# Altium project PrintingProjectAllDocs.PrjPCB (part 3 of 3)

## Sheet TemperatureSensorBlock.SchDoc: Temperature Sensor Controller
size B; Author: Levi Balling; CompanyName: Smart Home; DrawnBy: Levi Balling; Engineer: Levi Balling; Organization: U of U Computer Engineering; Address1: 50 S. Central Campus Dr.; Address2: Rm. 3280 MEB; Address3: Salt Lake City, UT; Address4: Australia 2086; DocumentNumber: 1; Revision: 2; SheetNumber: 10; SheetTotal: 13; Website: www.eng.utah.edu/~lballing/SmartHome; Project: Smart Home; Description: This board will Take temperature samples from 32 locations; ProjectName: Smart Home
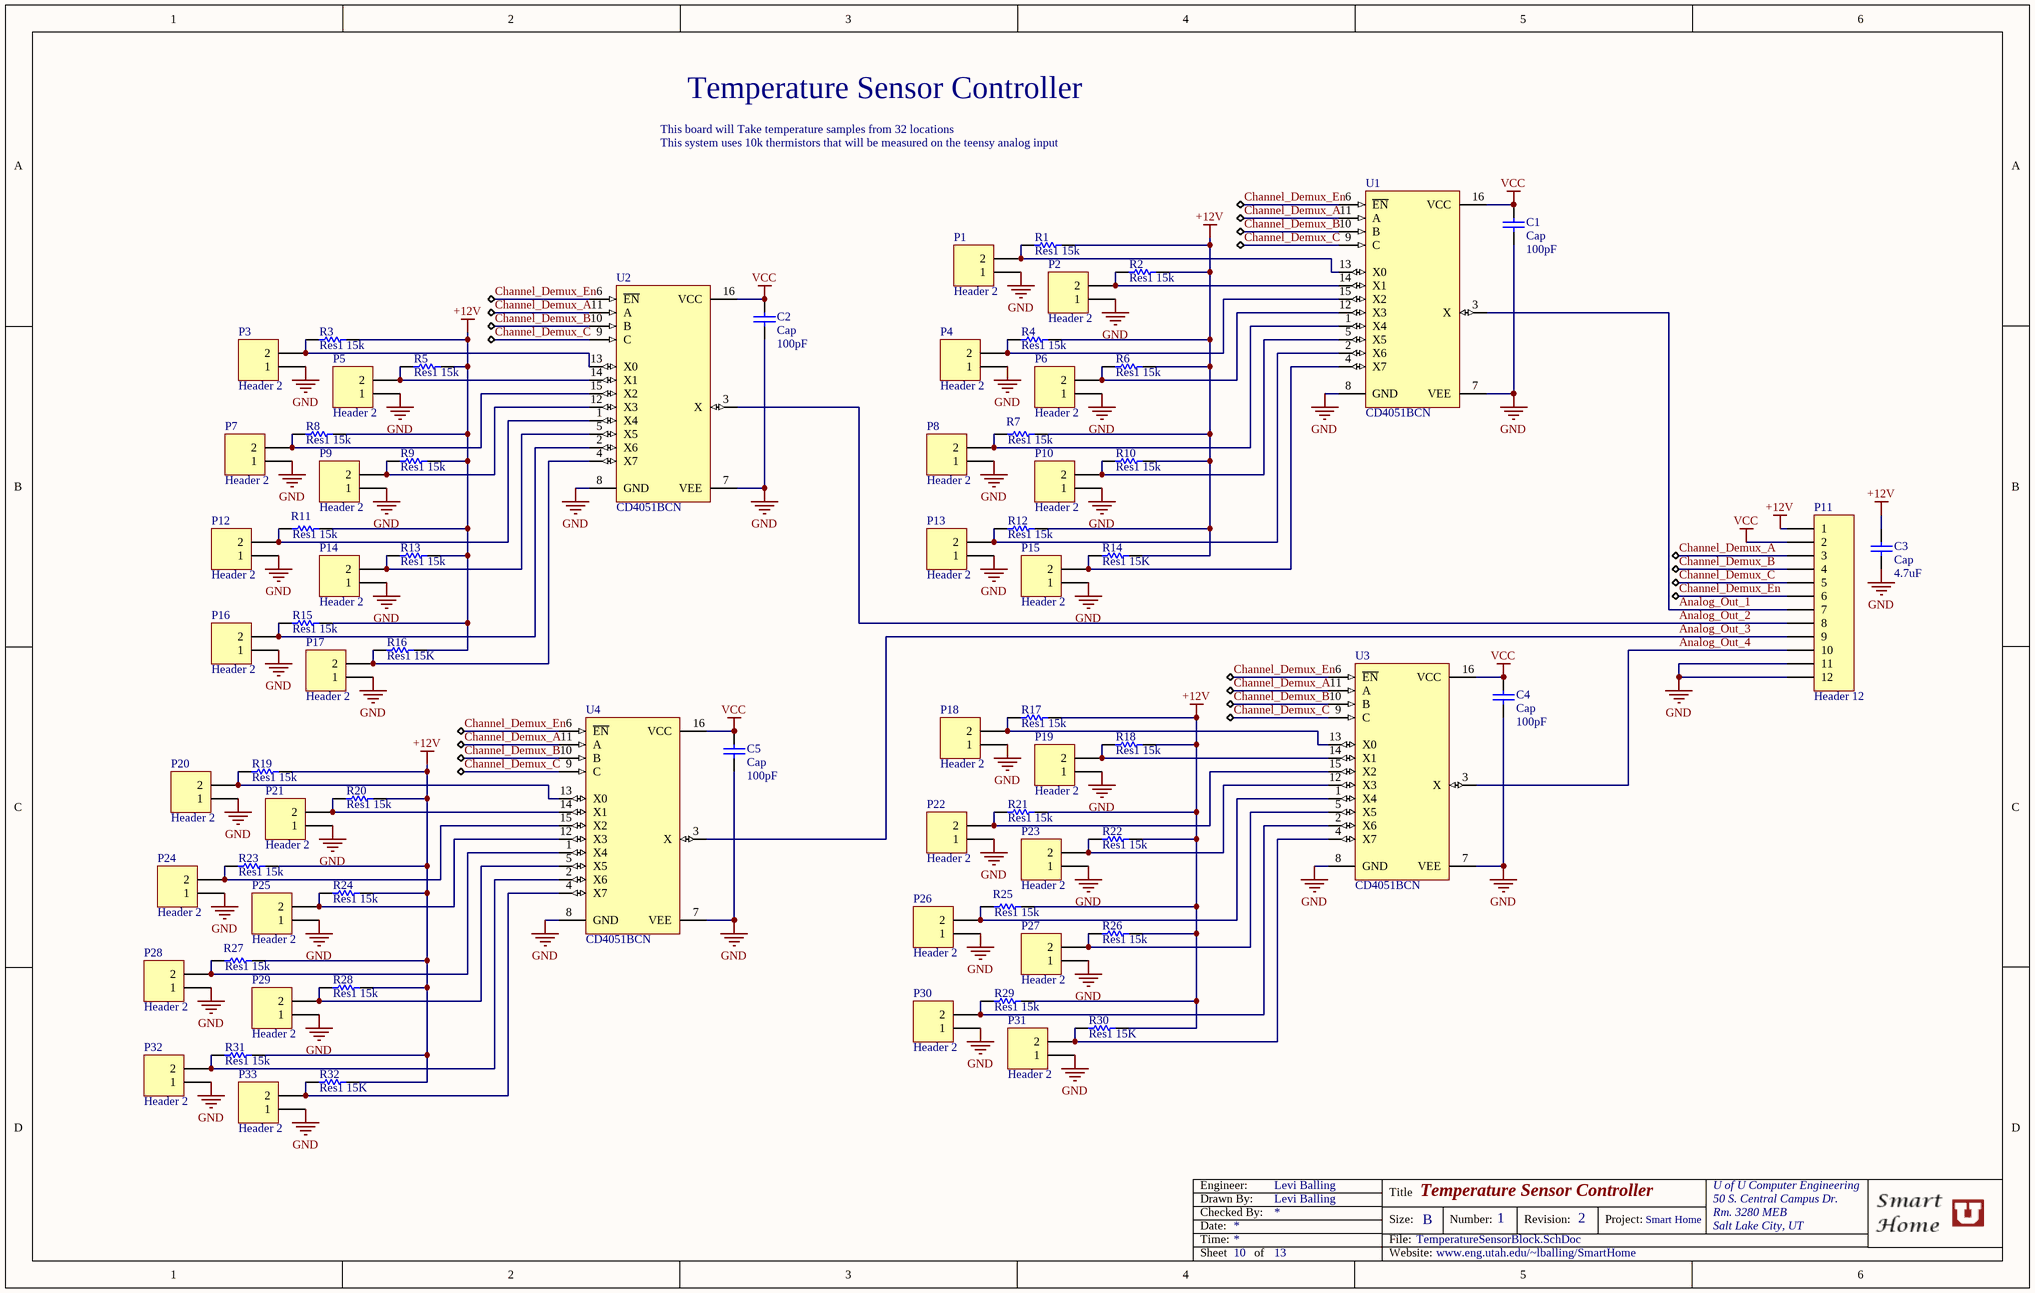
[diagram p10: TemperatureSensorBlock.SchDoc]

### Parts
(Parts that share a designator on the sheet are numbered #1, #2 ... from top to bottom, then left to right.)
C1#6  Cap  value 100pF  [RAD-0.3]
C2#6  Cap  value 100pF  [RAD-0.3]
C3#5  Cap  value 4.7uF  [RAD-0.3]
C4#5  Cap  value 100pF  [RAD-0.3]
C5#4  Cap  value 100pF  [RAD-0.3]
P1#12  Header 2  [HDR1X2]
P2#13  Header 2  [HDR1X2]
P3#12  Header 2  [HDR1X2]
P4#10  Header 2  [HDR1X2]
P5#10  Header 2  [HDR1X2]
P6#7  Header 2  [HDR1X2]
P7#6  Header 2  [HDR1X2]
P8#5  Header 2  [HDR1X2]
P9#4  Header 2  [HDR1X2]
P10#5  Header 2  [HDR1X2]
P11#3  Header 12  [HDR1X12]
P12#2  Header 2  [HDR1X2]
P13#3  Header 2  [HDR1X2]
P14#3  Header 2  [HDR1X2]
P15#2  Header 2  [HDR1X2]
P16#2  Header 2  [HDR1X2]
P17#2  Header 2  [HDR1X2]
P18#2  Header 2  [HDR1X2]
P19#2  Header 2  [HDR1X2]
P20  Header 2  [HDR1X2]
P21  Header 2  [HDR1X2]
P22  Header 2  [HDR1X2]
P23  Header 2  [HDR1X2]
P24  Header 2  [HDR1X2]
P25  Header 2  [HDR1X2]
P26  Header 2  [HDR1X2]
P27  Header 2  [HDR1X2]
P28  Header 2  [HDR1X2]
P29  Header 2  [HDR1X2]
P30  Header 2  [HDR1X2]
P31  Header 2  [HDR1X2]
P32  Header 2  [HDR1X2]
P33  Header 2  [HDR1X2]
R1#9  Res1  value 15k  [AXIAL-0.3]
R2#10  Res1  value 15k  [AXIAL-0.3]
R3#9  Res1  value 15k  [AXIAL-0.3]
R4#9  Res1  value 15k  [AXIAL-0.3]
R5#9  Res1  value 15k  [AXIAL-0.3]
R6#8  Res1  value 15k  [AXIAL-0.3]
R7#8  Res1  value 15k  [AXIAL-0.3]
R8#8  Res1  value 15k  [AXIAL-0.3]
R9#7  Res1  value 15k  [AXIAL-0.3]
R10#7  Res1  value 15k  [AXIAL-0.3]
R11#7  Res1  value 15k  [AXIAL-0.3]
R12#7  Res1  value 15k  [AXIAL-0.3]
R13#7  Res1  value 15k  [AXIAL-0.3]
R14#7  Res1  value 15K  [AXIAL-0.3]
R15#6  Res1  value 15k  [AXIAL-0.3]
R16#6  Res1  value 15K  [AXIAL-0.3]
R17#6  Res1  value 15k  [AXIAL-0.3]
R18#5  Res1  value 15k  [AXIAL-0.3]
R19#5  Res1  value 15k  [AXIAL-0.3]
R20#5  Res1  value 15k  [AXIAL-0.3]
R21#5  Res1  value 15k  [AXIAL-0.3]
R22#5  Res1  value 15k  [AXIAL-0.3]
R23#4  Res1  value 15k  [AXIAL-0.3]
R24#3  Res1  value 15k  [AXIAL-0.3]
R25#3  Res1  value 15k  [AXIAL-0.3]
R26#3  Res1  value 15k  [AXIAL-0.3]
R27#3  Res1  value 15k  [AXIAL-0.3]
R28#3  Res1  value 15k  [AXIAL-0.3]
R29#3  Res1  value 15k  [AXIAL-0.3]
R30#3  Res1  value 15K  [AXIAL-0.3]
R31#3  Res1  value 15k  [AXIAL-0.3]
R32#3  Res1  value 15K  [AXIAL-0.3]
U1#8  CD4051BCN  [N16E]
U2#8  CD4051BCN  [N16E]
U3#6  CD4051BCN  [N16E]
U4#6  CD4051BCN  [N16E]

### Nets
+12V: C3#5.2 P11#3.1 R1#9.1 R2#10.1 R3#9.1 R4#9.1 R5#9.1 R6#8.1 R7#8.1 R8#8.1 R9#7.1 R10#7.1 R11#7.1 R12#7.1 R13#7.1 R14#7.1 R15#6.1 R16#6.1 R17#6.1 R18#5.1 R19#5.1 R20#5.1 R21#5.1 R22#5.1 R23#4.1 R24#3.1 R25#3.1 R26#3.1 R27#3.1 R28#3.1 R29#3.1 R30#3.1 R31#3.1 R32#3.1  [project net VCC12]
GND: C1#6.1 C2#6.1 C3#5.1 C4#5.1 C5#4.1 P1#12.1 P2#13.1 P3#12.1 P4#10.1 P5#10.1 P6#7.1 P7#6.1 P8#5.1 P9#4.1 P10#5.1 P11#3.11 P11#3.12 P12#2.1 P13#3.1 P14#3.1 P15#2.1 P16#2.1 P17#2.1 P18#2.1 P19#2.1 P20.1 P21.1 P22.1 P23.1 P24.1 P25.1 P26.1 P27.1 P28.1 P29.1 P30.1 P31.1 P32.1 P33.1 U1#8.7(VEE) U1#8.8(GND) U2#8.7(VEE) U2#8.8(GND) U3#6.7(VEE) U3#6.8(GND) U4#6.7(VEE) U4#6.8(GND)  [project net DampVCC12]
VCC: C1#6.2 C2#6.2 C4#5.2 C5#4.2 P11#3.2 U1#8.16(VCC) U2#8.16(VCC) U3#6.16(VCC) U4#6.16(VCC)
Analog_Out_1: P11#3.7 U1#8.3(X)
Analog_Out_2: P11#3.8 U2#8.3(X)
Analog_Out_3: P11#3.9 U4#6.3(X)
Analog_Out_4: P11#3.10 U3#6.3(X)
Channel_Demux_A: P11#3.3 U1#8.11(A) U2#8.11(A) U3#6.11(A) U4#6.11(A)
Channel_Demux_B: P11#3.4 U1#8.10(B) U2#8.10(B) U3#6.10(B) U4#6.10(B)
Channel_Demux_C: P11#3.5 U1#8.9(C) U2#8.9(C) U3#6.9(C) U4#6.9(C)
Channel_Demux_En: P11#3.6 U1#8.6(~{EN}) U2#8.6(~{EN}) U3#6.6(~{EN}) U4#6.6(~{EN})
NetP1#12_2: P1#12.2 R1#9.2 U1#8.13(X0)
NetP2#13_2: P2#13.2 R2#10.2 U1#8.14(X1)
NetP3#12_2: P3#12.2 R3#9.2 U2#8.13(X0)
NetP4#10_2: P4#10.2 R4#9.2 U1#8.15(X2)
NetP5#10_2: P5#10.2 R5#9.2 U2#8.14(X1)
NetP6#7_2: P6#7.2 R6#8.2 U1#8.12(X3)
NetP7#6_2: P7#6.2 R8#8.2 U2#8.15(X2)
NetP8#5_2: P8#5.2 R7#8.2 U1#8.1(X4)
NetP9#4_2: P9#4.2 R9#7.2 U2#8.12(X3)
NetP10#5_2: P10#5.2 R10#7.2 U1#8.5(X5)
NetP12#2_2: P12#2.2 R11#7.2 U2#8.1(X4)
NetP13#3_2: P13#3.2 R12#7.2 U1#8.2(X6)
NetP14#3_2: P14#3.2 R13#7.2 U2#8.5(X5)
NetP15#2_2: P15#2.2 R14#7.2 U1#8.4(X7)
NetP16#2_2: P16#2.2 R15#6.2 U2#8.2(X6)
NetP17#2_2: P17#2.2 R16#6.2 U2#8.4(X7)
NetP18#2_2: P18#2.2 R17#6.2 U3#6.13(X0)
NetP19#2_2: P19#2.2 R18#5.2 U3#6.14(X1)
NetP20_2: P20.2 R19#5.2 U4#6.13(X0)
NetP21_2: P21.2 R20#5.2 U4#6.14(X1)
NetP22_2: P22.2 R21#5.2 U3#6.15(X2)
NetP23_2: P23.2 R22#5.2 U3#6.12(X3)
NetP24_2: P24.2 R23#4.2 U4#6.15(X2)
NetP25_2: P25.2 R24#3.2 U4#6.12(X3)
NetP26_2: P26.2 R25#3.2 U3#6.1(X4)
NetP27_2: P27.2 R26#3.2 U3#6.5(X5)
NetP28_2: P28.2 R27#3.2 U4#6.1(X4)
NetP29_2: P29.2 R28#3.2 U4#6.5(X5)
NetP30_2: P30.2 R29#3.2 U3#6.2(X6)
NetP31_2: P31.2 R30#3.2 U3#6.4(X7)
NetP32_2: P32.2 R31#3.2 U4#6.2(X6)
NetP33_2: P33.2 R32#3.2 U4#6.4(X7)

### Notes on the sheet
- This system uses 10k thermistors that will be measured on the teensy analog input
- Date:
- Time:
- Engineer:
- Drawn By:
- Checked By:
- Title
- Size:
- File:
- B
- Number:
- Revision:
- Project:
- Sheet
- of
- Website:

### Library data of the parts
C1#6 C2#6 C3#5 C4#5 C5#4 = Cap: Capacitor; Vendor: Taydaelectronics; Published: 8-Jun-2000; LatestRevisionDate: 17-Jul-2002; LatestRevisionNote: Re-released for DXP Platform.; PackageReference: RAD-0.3; Publisher: Altium Limited; PackageDescription: Radial Cap, Thru-Hole; 2 Leads; 0.3 in Pin Spacing; Price: 0.03
P1#12 P2#13 P3#12 P4#10 P5#10 P6#7 P7#6 P8#5 P9#4 P10#5 P12#2 P13#3 P14#3 P15#2 P16#2 P17#2 P18#2 P19#2 P20-P33 = Header 2: Header, 2-Pin; Vendor: Taydaelectronics; LatestRevisionDate: 17-Jul-2002; LatestRevisionNote: Re-released for DXP Platform.; Publisher: Altium Limited; Price: 0.02; Value: Header 2
P11#3 = Header 12: Header, 12-Pin; Vendor: Taydaelectronics; LatestRevisionDate: 17-Jul-2002; LatestRevisionNote: Re-released for DXP Platform.; Publisher: Altium Limited; Price: 0.12; Value: Header 12
R1#9 R2#10 R3#9 R4#9 R5#9 R6#8 R7#8 R8#8 R9#7 R10#7 R11#7 R12#7 R13#7 R14#7 R15#6 R16#6 R17#6 R18#5 R19#5 R20#5 R21#5 R22#5 R23#4 R24#3 R25#3 R26#3 R27#3 R28#3 R29#3 R30#3 R31#3 R32#3 = Res1: Resistor; Vendor: Taydaelectronics; Published: 8-Jun-2000; LatestRevisionDate: 17-Jul-2002; LatestRevisionNote: Re-released for DXP Platform.; PackageReference: AXIAL-0.3; Publisher: Altium Limited; PackageDescription: Axial Device, Thru-Hole; 2 Leads; 0.3 in Pin Spacing; Price: 0.01
U1#8 U2#8 U3#6 U4#6 = CD4051BCN: 8-Channel Analog Multiplexer/Demultiplexer; Vendor: Taydaelectronics; Published: 17-Jul-2002; LatestRevisionDate: 29-May-2009; LatestRevisionNote: Component Body Added.; DatasheetVersion: Jan-1999; PackageVersion: 2000; PackageReference: N16E; Publisher: Altium Limited; PackageDescription: DIP, 16-Pin, Row Spacing 7.62 mm, Pitch 2.54 mm; ComponentLink1URL: http://www.fairchildsemi.com/; ComponentLink2Description: Datasheet; ComponentLink2URL: http://www.fairchildsemi.com/ds/CD%2FCD4052BC.pdf; Price: 0.23; Value: CD4051BCN

## Sheet TheEpicCube.SchDoc: The Epic Cube
size B; CompanyName: Smart Home; DrawnBy: Levi Balling; Engineer: Levi Balling; Organization: U of U Computer Engineering; Address1: 50 S. Central Campus Dr.; Address2: Rm. 3280 MEB; Address3: Salt Lake City, UT; Address4: Australia 2086; DocumentNumber: 1; Revision: 1; SheetNumber: 1; SheetTotal: 13; Website: www.eng.utah.edu/~lballing/SmartHome; Project: Smart Home; DocumentName: Title Page; ProjectName: Smart Home
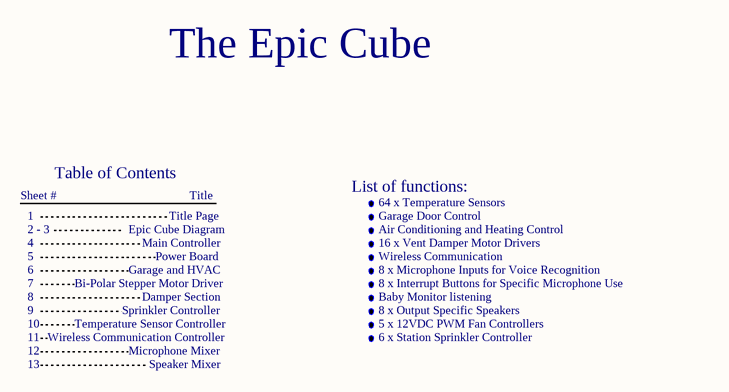
[diagram p11: TheEpicCube.SchDoc]

### Notes on the sheet
- The Epic Cube
- Sheet #
- 1
- Table of Contents
- Title Page
- Title
- List of functions:
- 64 x Temperature Sensors
- Garage Door Control
- 2 - 3
- 4
- 5
- 6
- 7
- Bi-Polar Stepper Motor Driver
- Epic Cube Diagram
- Garage and HVAC
- Main Controller
- Power Board
- Air Conditioning and Heating Control
- 16 x Vent Damper Motor Drivers
- Wireless Communication
- 8 x Microphone Inputs for Voice Recognition
- 8 x Interrupt Buttons for Specific Microphone Use
- 8
- 9
- 10
- 11
- 12
- Wireless Communication Controller
- Temperature Sensor Controller
- Sprinkler Controller
- Microphone Mixer
- Damper Section
- Baby Monitor listening
- 8 x Output Specific Speakers
- 5 x 12VDC PWM Fan Controllers
- 6 x Station Sprinkler Controller
- 13
- Speaker Mixer
- Date:
- Time:
- Engineer:
- Drawn By:
- Checked By:
- Size:
- File:
- B
- Number:
- Revision:
- Project:
- Sheet
- of
- Website:

## Sheet WirelessCommunications.SchDoc: Wireless Communication Controller
size B; Author: Levi Balling; CompanyName: Smart Home; DrawnBy: Levi Balling; Engineer: Levi Balling; Organization: U of U Computer Engineering; Address1: 50 S. Central Campus Dr.; Address2: Rm. 3280 MEB; Address3: Salt Lake City, UT; Address4: Australia 2086; DocumentNumber: 1; Revision: 1; SheetNumber: 11; SheetTotal: 13; Website: www.eng.utah.edu/~lballing/SmartHome; Project: Smart Home; Description: This board will control a Mic Mixer system, Speaker Mixer System, and communicate wirelessly to other RF modules; ProjectName: Smart Home
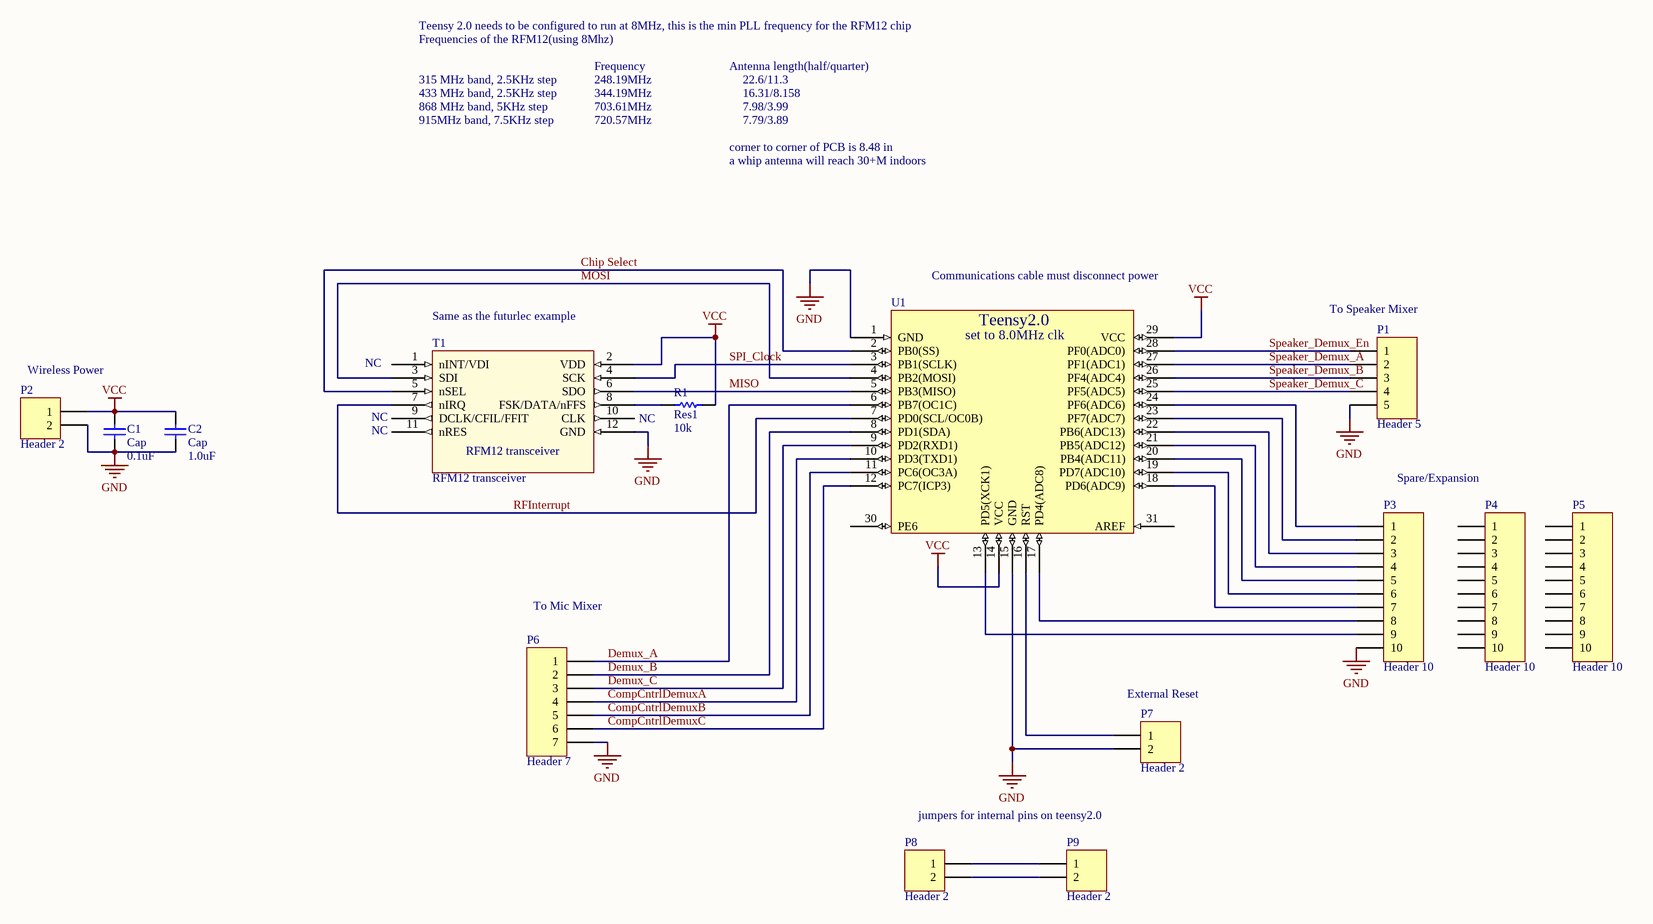
[diagram p12: WirelessCommunications.SchDoc]

### Parts
(Parts that share a designator on the sheet are numbered #1, #2 ... from top to bottom, then left to right.)
C1#7  Cap  value 0.1uF  [RAD-0.3]
C2#7  Cap  value 1.0uF  [RAD-0.3]
P1#13  Header 5  [HDR1X5]
P2#14  Header 2  [HDR1X2]
P3#13  Header 10  [HDR1X10]
P4#11  Header 10  [HDR1X10]
P5#11  Header 10  [HDR1X10]
P6#8  Header 7  [HDR1X7]
P7#7  Header 2  [HDR1X2]
P8#6  Header 2  [HDR1X2]
P9#5  Header 2  [HDR1X2]
R1#10  Res1  value 10k  [AXIAL-0.3]
T1  RFM12 transceiver  [RFM12-transceiver]
U1#9  Teensy  [Teensy2.0]  (value not drawn)

### Nets
GND: C1#7.1 C2#7.1 P1#13.5 P2#14.2 P3#13.10 P6#8.7 P7#7.2 T1.12(GND) U1#9.1(GND) U1#9.15(GND)  [project net DampVCC12]
VCC: C1#7.2 C2#7.2 P2#14.1 R1#10.1 T1.2(VDD) U1#9.14(VCC) U1#9.29(VCC)
Chip Select: T1.5(nSEL) U1#9.2(PB0(SS))
CompCntrlDemuxA: P6#8.4 U1#9.10(PD3(TXD1))
CompCntrlDemuxB: P6#8.5 U1#9.11(PC6(OC3A))
CompCntrlDemuxC: P6#8.6 U1#9.12(PC7(ICP3))
Demux_A: P6#8.1 U1#9.6(PB7(OC1C))
Demux_B: P6#8.2 U1#9.8(PD1(SDA))
Demux_C: P6#8.3 U1#9.9(PD2(RXD1))
MISO: T1.6(SDO) U1#9.5(PB3(MISO))
MOSI: T1.3(SDI) U1#9.4(PB2(MOSI))
RFInterrupt: T1.7(nIRQ) U1#9.7(PD0(SCL/OC0B))
Speaker_Demux_A: P1#13.2 U1#9.27(PF1(ADC1))
Speaker_Demux_B: P1#13.3 U1#9.26(PF4(ADC4))
Speaker_Demux_C: P1#13.4 U1#9.25(PF5(ADC5))
Speaker_Demux_En: P1#13.1 U1#9.28(PF0(ADC0))
SPI_Clock: T1.4(SCK) U1#9.3(PB1(SCLK))
NetP3#13_1: P3#13.1 U1#9.24(PF6(ADC6))
NetP3#13_2: P3#13.2 U1#9.23(PF7(ADC7))
NetP3#13_3: P3#13.3 U1#9.22(PB6(ADC13))
NetP3#13_4: P3#13.4 U1#9.21(PB5(ADC12))
NetP3#13_5: P3#13.5 U1#9.20(PB4(ADC11))
NetP3#13_6: P3#13.6 U1#9.19(PD7(ADC10))
NetP3#13_7: P3#13.7 U1#9.18(PD6(ADC9))
NetP3#13_8: P3#13.8 U1#9.17(PD4(ADC8))
NetP3#13_9: P3#13.9 U1#9.13(PD5(XCK1))
NetP7#7_1: P7#7.1 U1#9.16(RST)
NetP8#6_1: P8#6.1 P9#5.1
NetP8#6_2: P8#6.2 P9#5.2
NetR1#10_2: R1#10.2 T1.8(FSK/DATA/nFFS)

Not connected (* = marked no-connect by the designer): P4#11 1 2 3 4 5 6 7 8 9 10; P5#11 1 2 3 4 5 6 7 8 9 10; T1 1(nINT/VDI) 9(DCLK/CFIL/FFIT) 10(CLK) 11(nRES); U1#9 30(PE6) 31(AREF)

### Notes on the sheet
- Teensy 2.0 needs to be configured to run at 8MHz, this is the min PLL frequency for the RFM12 chip
- Frequencies of the RFM12(using 8Mhz)
- Frequency
- Antenna length(half/quarter)
- 315 MHz band, 2.5KHz step
- 433 MHz band, 2.5KHz step
- 868 MHz band, 5KHz step
- 915MHz band, 7.5KHz step
- 248.19MHz
- 344.19MHz
- 703.61MHz
- 720.57MHz
- 22.6/11.3
- 16.31/8.158
- 7.98/3.99
- 7.79/3.89
- corner to corner of PCB is 8.48 in
- a whip antenna will reach 30+M indoors
- Communications cable must disconnect power
- (near T1) Same as the futurlec example
- (near P1#13) To Speaker Mixer
- Wireless Power
- NC
- (near T1) NC
- (near R1#10) NC
- Spare/Expansion
- (near P6#8) To Mic Mixer
- (near P7#7) External Reset
- jumpers for internal pins on teensy2.0
- Date:
- Time:
- Engineer:
- Drawn By:
- Checked By:
- Title
- Size:
- File:
- B
- Number:
- Revision:
- Project:
- Sheet
- of
- Website:
- (in symbol Teensy2.0) set to 8.0MHz clk

### Library data of the parts
C1#7 C2#7 = Cap: Capacitor; Vendor: Taydaelectronics; Published: 8-Jun-2000; LatestRevisionDate: 17-Jul-2002; LatestRevisionNote: Re-released for DXP Platform.; PackageReference: RAD-0.3; Publisher: Altium Limited; PackageDescription: Radial Cap, Thru-Hole; 2 Leads; 0.3 in Pin Spacing; Price: 0.03
P1#13 = Header 5: Header, 5-Pin; Vendor: Taydaelectronics; LatestRevisionDate: 17-Jul-2002; LatestRevisionNote: Re-released for DXP Platform.; Publisher: Altium Limited; Price: 0.05; Value: Header 5
P2#14 P7#7 P8#6 P9#5 = Header 2: Header, 2-Pin; Vendor: Taydaelectronics; LatestRevisionDate: 17-Jul-2002; LatestRevisionNote: Re-released for DXP Platform.; Publisher: Altium Limited; Price: 0.02; Value: Header 2
P3#13 P4#11 P5#11 = Header 10: Header, 10-Pin; Vendor: Taydaelectronics; LatestRevisionDate: 17-Jul-2002; LatestRevisionNote: Re-released for DXP Platform.; Publisher: Altium Limited; Price: 0.10; Value: Header 10
P6#8 = Header 7: Header, 7-Pin; Vendor: Taydaelectronics; LatestRevisionDate: 17-Jul-2002; LatestRevisionNote: Re-released for DXP Platform.; Publisher: Altium Limited; Price: 0.07; Value: Header 7
R1#10 = Res1: Resistor; Vendor: Taydaelectronics; Published: 8-Jun-2000; LatestRevisionDate: 17-Jul-2002; LatestRevisionNote: Re-released for DXP Platform.; PackageReference: AXIAL-0.3; Publisher: Altium Limited; PackageDescription: Axial Device, Thru-Hole; 2 Leads; 0.3 in Pin Spacing; Price: 0.01
T1 = RFM12 transceiver: www.futurlec.com 433 MHZ transceiver; Price: 7.90; Vendor: futurlec; Value: RFM12 transceiver
U1#9 = Teensy2.0: The teensy 2.0 from www.PJRC.com, chang clock to 8MHz; Vendor: PJRC; Price: 16.00; Value: Teensy2.0

## Nets that join several sheets
+24V: MainController (6 pins), MotorController (10 pins), PowerAndFanBoard (16 pins)
-5: MicMixer (13 pins), SpeakerMixer (P1#10.2 U1#6.7 U2#6.7)
DampVCC12: DamperSection (33 pins), EpicCubeDiagram (36 pins), EpicCubeDiagram2 (44 pins), HeatingAC_Garage (27 pins), MainController (67 pins), MicMixer (58 pins), MotorController (26 pins), PowerAndFanBoard (95 pins), SpeakerMixer (17 pins), SprinklerBoard (21 pins), TemperatureSensorBlock (47 pins), WirelessCommunications (10 pins)
VCC: DamperSection (P3#1.7 R1#1.2 R2#1.2), HeatingAC_Garage (U2#1.14), MainController (10 pins), MicMixer (23 pins), MotorController (17 pins), PowerAndFanBoard (U2#5.14 U4#5.14 U6#2.14), SpeakerMixer (7 pins), SprinklerBoard (U1#7.14), TemperatureSensorBlock (9 pins), WirelessCommunications (7 pins)
VCC12: DamperSection (25 pins), MainController (38 pins), SprinklerBoard (13 pins), TemperatureSensorBlock (34 pins)
Analog_In_1: EpicCubeDiagram (P13#1.7 P?#8.5), MainController (P13#2.5 U4#2.33)
Analog_In_2: EpicCubeDiagram (P13#1.8 P?#8.6), MainController (P13#2.6 U4#2.34)
Analog_In_3: EpicCubeDiagram (P13#1.9 P?#8.7), MainController (P13#2.7 U4#2.35)
Analog_In_4: EpicCubeDiagram (P13#1.10 P?#8.8), MainController (P13#2.8 U4#2.36)
Analog_In_5: EpicCubeDiagram (P14#1.7 P?#11.5), MainController (P15#1.5 U4#2.37)
Analog_In_6: EpicCubeDiagram (P14#1.8 P?#11.6), MainController (P15#1.6 U4#2.38)
Analog_In_7: EpicCubeDiagram (P14#1.9 P?#11.7), MainController (P15#1.7 U4#2.39)
Analog_In_8: EpicCubeDiagram (P14#1.10 P?#11.8), MainController (P15#1.8 U4#2.40)
babyMicToPC: EpicCubeDiagram2 (P?#21.2 P?#24.2), MicMixer (C6#2.1 P11#2.2 R4#4.2)
ButtonCloseBus: DamperSection (6 pins), EpicCubeDiagram (5 pins), MainController (P9#1.2 U4#2.4)
ButtonOpenBus: DamperSection (6 pins), EpicCubeDiagram (5 pins), MainController (P9#1.1 U4#2.5)
CoilA1Bus: DamperSection (5 pins), EpicCubeDiagram (5 pins)
CoilA2Bus: DamperSection (5 pins), EpicCubeDiagram (5 pins)
CoilB1Bux: DamperSection (5 pins), EpicCubeDiagram (5 pins)
CoilB2Bus: DamperSection (5 pins), EpicCubeDiagram (5 pins)
CompCntrlDemuxA: EpicCubeDiagram2 (P?#12.6 P?#35.4), MicMixer (P1#7.6 U3#3.11), WirelessCommunications (P6#8.4 U1#9.10)
CompCntrlDemuxB: EpicCubeDiagram2 (P?#12.7 P?#35.5), MicMixer (P1#7.7 U3#3.10), WirelessCommunications (P6#8.5 U1#9.11)
CompCntrlDemuxC: EpicCubeDiagram2 (P?#12.8 P?#35.6), MicMixer (P1#7.8 U3#3.9), WirelessCommunications (P6#8.6 U1#9.12)
Damper1: DamperSection (5 pins), EpicCubeDiagram (P3#4.2 P?#2.2)
Damper2: DamperSection (5 pins), EpicCubeDiagram (P3#4.3 P?#2.3)
Damper3: DamperSection (5 pins), EpicCubeDiagram (P3#4.4 P?#2.4)
Damper4: DamperSection (5 pins), EpicCubeDiagram (P3#4.5 P?#2.5)
Demux_A: EpicCubeDiagram (6 pins), MainController (5 pins), MicMixer (P1#7.3 U1#3.11 U4#3.11), SpeakerMixer (P1#10.4 R3#7.1 U1#6.11 U2#6.11), SprinklerBoard (P1#11.3 U2#7.1), WirelessCommunications (P6#8.1 U1#9.6)
Demux_B: EpicCubeDiagram (6 pins), MainController (5 pins), MicMixer (P1#7.4 U1#3.10 U4#3.10), SpeakerMixer (P1#10.5 R4#7.1 U1#6.10 U2#6.10), SprinklerBoard (P1#11.4 U2#7.2), WirelessCommunications (P6#8.2 U1#9.8)
Demux_C: EpicCubeDiagram (6 pins), MainController (5 pins), MicMixer (P1#7.5 U1#3.9 U4#3.9), SpeakerMixer (P1#10.6 R7#6.1 U1#6.9 U2#6.9), SprinklerBoard (P1#11.5 U2#7.3), WirelessCommunications (P6#8.3 U1#9.9)
Direction1: EpicCubeDiagram (P1#3.4 P4#2.3), MainController (P4#6.3 U4#2.22), MotorController (P1#8.4 R18#3.2)
Direction2: EpicCubeDiagram (P1#3.5 P4#2.4), MainController (P4#6.4 U4#2.23), MotorController (P1#8.5 R22#3.2)
G_Trigger: EpicCubeDiagram (P2#2.3 P10#1.1), HeatingAC_Garage (P2#7.1 U2#1.2), MainController (P11#1.1 U4#2.14)
Garage_Switch: EpicCubeDiagram (P3#2.2 P5#4.1), HeatingAC_Garage (P3#7.6 R2#2.1 R7#2.1), MainController (P10#2.1 U4#2.7)
ListenInterruptMicToPC: EpicCubeDiagram2 (P?#17.2 P?#20.2), MicMixer (C16#1.1 P10#3.2 R8#3.2)
MicVCC+5: EpicCubeDiagram2 (11 pins), PowerAndFanBoard (10 pins)
NC: EpicCubeDiagram (P?#1.1), EpicCubeDiagram2 (P?#40.1)
PC+5V_ListenInterrupt: EpicCubeDiagram2 (P?#17.1 P?#20.1), MicMixer (C11#1.2 P10#3.1)
PC_Ring_-5V_Sig: EpicCubeDiagram2 (P?#28.2 P?#37.2), SpeakerMixer (P2#12.2 U2#6.3)
PC_TIP_+5_Sig: EpicCubeDiagram2 (P?#28.1 P?#37.1), SpeakerMixer (P2#12.1 U1#6.3)
PD5_G_Fan_Switch: EpicCubeDiagram (P3#2.3 P5#4.2), HeatingAC_Garage (P3#7.5 R5#2.1 R8#2.1), MainController (P10#2.2 U4#2.8)
PD6_W_Heat_Switch: EpicCubeDiagram (P3#2.4 P5#4.3), HeatingAC_Garage (P3#7.4 R2#3.1 R21#2.1), MainController (P10#2.3 U4#2.9)
PD7_Y_Cool_Switch: EpicCubeDiagram (P3#2.5 P5#4.4), HeatingAC_Garage (P3#7.3 R3#2.1 R23#2.1), MainController (P10#2.4 U4#2.10)
Speaker1_Ring_-5V_Sig: EpicCubeDiagram2 (P?#26.2), SpeakerMixer (P3#11.2 U2#6.13)
Speaker2_Ring_-5V_Sig: EpicCubeDiagram2 (P?#33.2), SpeakerMixer (P4#9.2 U2#6.14)
Speaker3_Ring_-5V_Sig: EpicCubeDiagram2 (P?#38.2), SpeakerMixer (P5#9.2 U2#6.15)
Speaker4_Ring_-5V_Sig: EpicCubeDiagram2 (P?#42.2), SpeakerMixer (P6#6.2 U2#6.12)
Speaker5_Ring_-5V_Sig: EpicCubeDiagram2 (P?#27.2), SpeakerMixer (P7#5.2 U2#6.1)
Speaker6_Ring_-5V_Sig: EpicCubeDiagram2 (P?#34.2), SpeakerMixer (P8#4.2 U2#6.5)
Speaker7_Ring_-5V_Sig: EpicCubeDiagram2 (P?#39.2), SpeakerMixer (P9#3.2 U2#6.2)
Speaker8_Ring_-5V_Sig: EpicCubeDiagram2 (P?#43.2), SpeakerMixer (P10#4.2 U2#6.4)
Speaker_Demux_A: EpicCubeDiagram2 (P?#32.2 P?#36.4), WirelessCommunications (P1#13.2 U1#9.27)
Speaker_Demux_En: EpicCubeDiagram2 (6 pins), WirelessCommunications (P1#13.1 U1#9.28)
Sprinkler_Demux_Enabled: EpicCubeDiagram (P?#9.6 P?#10.6), MainController (P6#3.6 U4#2.25), SprinklerBoard (P1#11.6 U2#7.6)
Step: EpicCubeDiagram (P4#2.5), MainController (P4#6.5 U4#2.24)
Step_Signal: EpicCubeDiagram (P1#3.3), MotorController (P1#8.3 R9#4.2)
W_Trigger: EpicCubeDiagram (P2#2.1 P10#1.3), HeatingAC_Garage (P2#7.2 U2#1.4), MainController (P11#1.3 U4#2.12)
WIFI_VCC5: EpicCubeDiagram2 (P5#5.1 P?#30.1), PowerAndFanBoard (5 pins)
Y_Trigger: EpicCubeDiagram (P2#2.2 P10#1.2), HeatingAC_Garage (P2#7.3 U2#1.6), MainController (P11#1.2 U4#2.13)